# Altium schematic sheet ZoM-Model-A.SchDoc: ZoM Mod A
size A4; Organization: Trenz Electronic GmbH / TT; DocumentNumber: 1; Revision: 01; SheetNumber: 1; SheetTotal: 13; Date: 12/16/2014
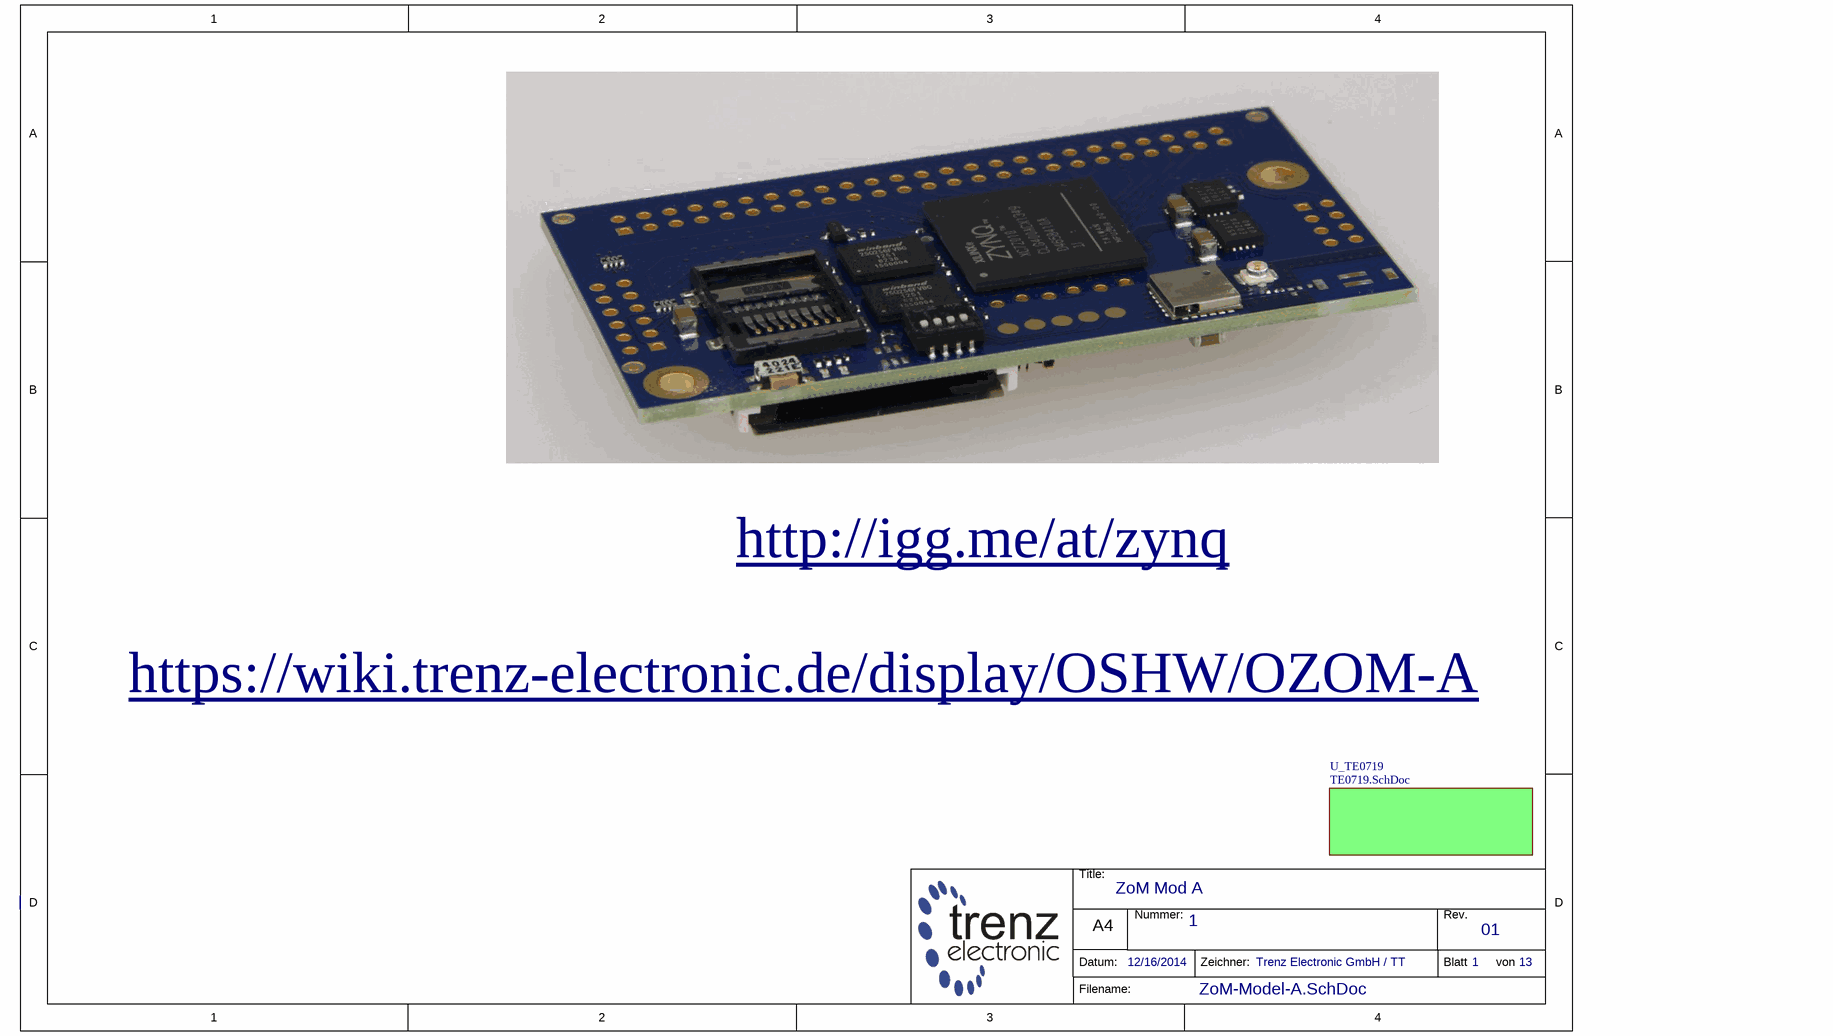
[diagram p0: ZoM-Model-A.SchDoc]

## Sub-sheets
U_TE0719 = TE0719.SchDoc: no entries

## Notes on the sheet
- http://igg.me/at/zynq
- https://wiki.trenz-electronic.de/display/OSHW/OZOM-A
- Title:
- Nummer:
- Rev.
- Datum:
- A4
- Zeichner:
- Blatt
- von
- Filename: